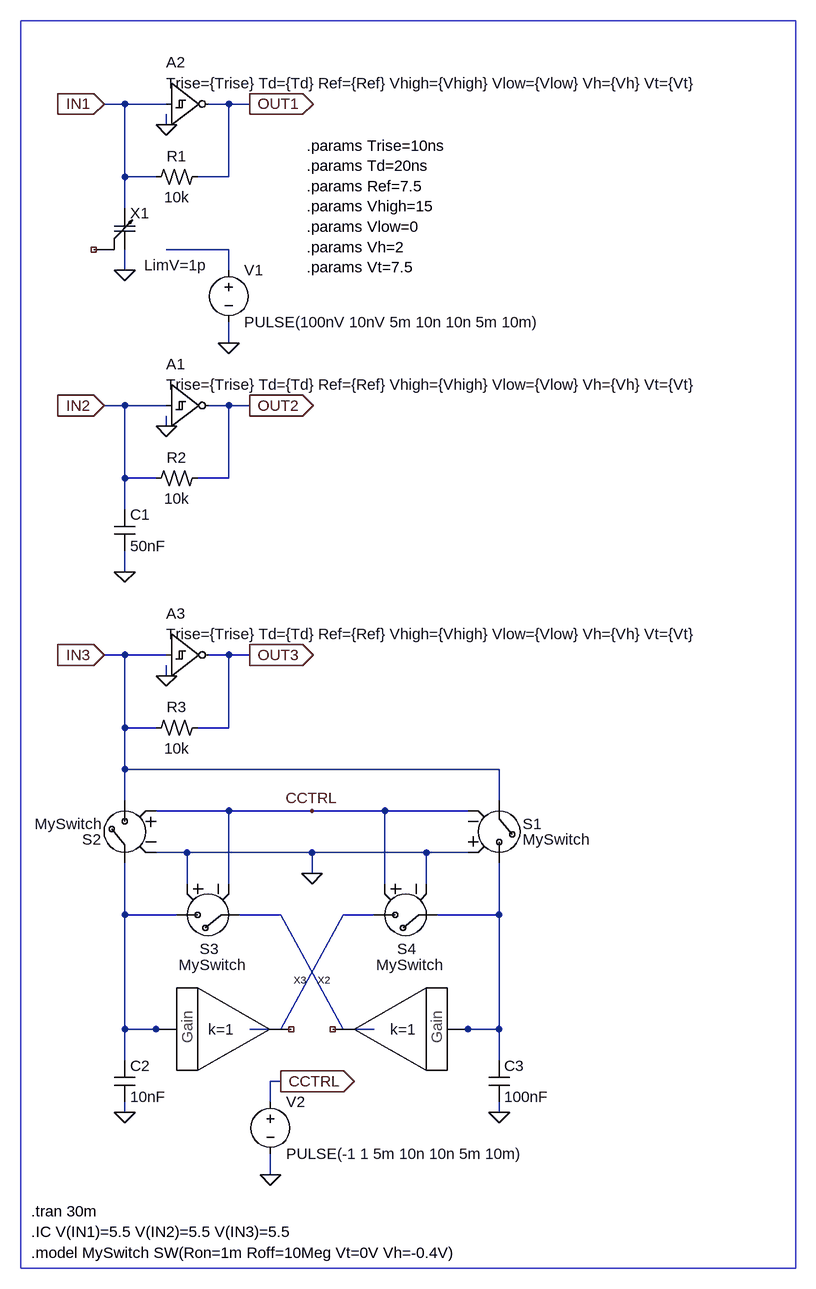
[diagram p0: schematic varicap-test.asc]
varicap-test.asc, the LTspice schematic file:
Version 4
SHEET 1 1536 1540
WIRE -224 -448 -256 -448
WIRE -160 -448 -224 -448
WIRE -64 -448 -96 -448
WIRE -32 -448 -64 -448
WIRE -160 -416 -160 -432
WIRE -224 -336 -224 -448
WIRE -176 -336 -224 -336
WIRE -64 -336 -64 -448
WIRE -64 -336 -112 -336
WIRE -224 -288 -224 -336
WIRE -64 -224 -160 -224
WIRE -224 -192 -224 -224
WIRE -64 -192 -64 -224
WIRE -64 -80 -64 -112
WIRE -224 16 -256 16
WIRE -160 16 -224 16
WIRE -64 16 -96 16
WIRE -32 16 -64 16
WIRE -160 48 -160 32
WIRE -224 128 -224 16
WIRE -176 128 -224 128
WIRE -64 128 -64 16
WIRE -64 128 -112 128
WIRE -224 176 -224 128
WIRE -224 272 -224 240
WIRE -224 400 -256 400
WIRE -160 400 -224 400
WIRE -64 400 -96 400
WIRE -32 400 -64 400
WIRE -160 432 -160 416
WIRE -224 512 -224 400
WIRE -176 512 -224 512
WIRE -64 512 -64 400
WIRE -64 512 -112 512
WIRE -224 576 -224 512
WIRE 352 576 -224 576
WIRE -224 624 -224 576
WIRE 352 624 352 576
WIRE -64 640 -176 640
WIRE 64 640 -64 640
WIRE 176 640 64 640
WIRE 304 640 176 640
WIRE -128 704 -176 704
WIRE 64 704 -128 704
WIRE 240 704 64 704
WIRE 304 704 240 704
WIRE 64 736 64 704
WIRE -128 752 -128 704
WIRE -64 752 -64 640
WIRE 176 752 176 640
WIRE 240 752 240 704
WIRE -224 800 -224 720
WIRE -144 800 -224 800
WIRE 16 800 -48 800
WIRE 160 800 112 800
WIRE 352 800 352 720
WIRE 352 800 256 800
WIRE -224 976 -224 800
WIRE -160 976 -224 976
WIRE 16 976 112 800
WIRE 16 976 -32 976
WIRE 112 976 16 800
WIRE 160 976 112 976
WIRE 352 976 352 800
WIRE 352 976 288 976
WIRE -224 1024 -224 976
WIRE 352 1024 352 976
WIRE 16 1056 0 1056
WIRE 0 1088 0 1056
WIRE -224 1104 -224 1088
WIRE 352 1104 352 1088
WIRE 0 1200 0 1168
FLAG -160 -416 0
FLAG -224 -192 0
FLAG -32 -448 OUT1
IOPIN -32 -448 Out
FLAG -256 -448 IN1
IOPIN -256 -448 In
FLAG -160 48 0
FLAG -32 16 OUT2
IOPIN -32 16 Out
FLAG -256 16 IN2
IOPIN -256 16 In
FLAG -224 272 0
FLAG -64 -80 0
FLAG -160 432 0
FLAG -32 400 OUT3
IOPIN -32 400 Out
FLAG -256 400 IN3
IOPIN -256 400 In
FLAG 0 1200 0
FLAG 16 1056 CCTRL
IOPIN 16 1056 Out
FLAG -224 1104 0
FLAG 352 1104 0
FLAG 64 640 CCTRL
FLAG 64 736 0
SYMBOL Digital\\schmtinv -160 -48 R0
WINDOW 0 0 0 Left 0
WINDOW 123 0 32 Left 0
SYMATTR InstName A1
SYMATTR Value2 Trise={Trise} Td={Td} Ref={Ref} Vhigh={Vhigh} Vlow={Vlow} Vh={Vh} Vt={Vt}
SYMBOL res2 -112 -352 R90
WINDOW 0 0 32 VBottom 0
WINDOW 3 32 32 VTop 0
SYMATTR InstName R1
SYMATTR Value 10k
SYMBOL Digital\\schmtinv -160 -512 R0
WINDOW 0 0 0 Left 0
WINDOW 123 0 32 Left 0
SYMATTR InstName A2
SYMATTR Value2 Trise={Trise} Td={Td} Ref={Ref} Vhigh={Vhigh} Vlow={Vlow} Vh={Vh} Vt={Vt}
SYMBOL res2 -112 112 R90
WINDOW 0 0 32 VBottom 0
WINDOW 3 32 32 VTop 0
SYMATTR InstName R2
SYMATTR Value 10k
SYMBOL cap -240 176 R0
SYMATTR InstName C1
SYMATTR Value 50nF
SYMBOL varicap -240 -288 R0
WINDOW 39 46 88 Left 0
SYMATTR SpiceLine LimV=1p
SYMATTR InstName X1
SYMBOL voltage -64 -208 R0
WINDOW 123 0 0 Left 0
WINDOW 39 0 0 Left 0
SYMATTR InstName V1
SYMATTR Value PULSE(100nV 10nV 5m 10n 10n 5m 10m)
SYMBOL Digital\\schmtinv -160 336 R0
WINDOW 0 0 0 Left 0
WINDOW 123 0 32 Left 0
SYMATTR InstName A3
SYMATTR Value2 Trise={Trise} Td={Td} Ref={Ref} Vhigh={Vhigh} Vlow={Vlow} Vh={Vh} Vt={Vt}
SYMBOL res2 -112 496 R90
WINDOW 0 0 32 VBottom 0
WINDOW 3 32 32 VTop 0
SYMATTR InstName R3
SYMATTR Value 10k
SYMBOL voltage 0 1072 R0
WINDOW 123 0 0 Left 0
WINDOW 39 0 0 Left 0
SYMATTR InstName V2
SYMATTR Value PULSE(-1 1 5m 10n 10n 5m 10m)
SYMBOL cap -240 1024 R0
SYMATTR InstName C2
SYMATTR Value 10nF
SYMBOL cap 336 1024 R0
SYMATTR InstName C3
SYMATTR Value 100nF
SYMBOL Gain -96 976 R0
WINDOW 39 0 0 Left 0
SYMATTR SpiceLine k=1
SYMATTR InstName X3
SYMBOL Gain 224 976 M0
WINDOW 39 0 0 Left 0
SYMATTR SpiceLine k=1
SYMATTR InstName X2
SYMBOL SWITCH 352 672 M180
SYMATTR InstName S1
SYMATTR Value MySwitch
SYMBOL SWITCH -224 672 M0
SYMATTR InstName S2
SYMATTR Value MySwitch
SYMBOL SWITCH -96 800 M90
WINDOW 0 52 -13 VRight 0
WINDOW 3 77 -45 VRight 0
SYMATTR InstName S3
SYMATTR Value MySwitch
SYMBOL SWITCH 208 800 M90
WINDOW 0 52 -13 VRight 0
WINDOW 3 77 -45 VRight 0
SYMATTR InstName S4
SYMATTR Value MySwitch
TEXT -368 1288 Left 0 !.IC V(IN1)=5.5 V(IN2)=5.5 V(IN3)=5.5
TEXT -368 1256 Left 0 !.tran 30m
TEXT 56 -384 Left 0 !.params Trise=10ns\n.params Td=20ns\n.params Ref=7.5\n.params Vhigh=15\n.params Vlow=0\n.params Vh=2\n.params Vt=7.5
TEXT -368 1320 Left 0 !.model MySwitch SW(Ron=1m Roff=10Meg Vt=0V Vh=-0.4V)
RECTANGLE Normal 808 1344 -384 -576

The netlist it stands for:
* varicap-test.asc
A1 IN2 0 0 0 0 OUT2 0 0 SCHMITT Trise={Trise} Td={Td} Ref={Ref} Vhigh={Vhigh} Vlow={Vlow} Vh={Vh} Vt={Vt}
R1 OUT1 IN1 10k
A2 IN1 0 0 0 0 OUT1 0 0 SCHMITT Trise={Trise} Td={Td} Ref={Ref} Vhigh={Vhigh} Vlow={Vlow} Vh={Vh} Vt={Vt}
R2 OUT2 IN2 10k
C1 IN2 0 50nF
XX1 IN1 0 NC_01 varicap LimV=1p  ; pins A B CTRL
V1 N001 0 PULSE(100nV 10nV 5m 10n 10n 5m 10m)
A3 IN3 0 0 0 0 OUT3 0 0 SCHMITT Trise={Trise} Td={Td} Ref={Ref} Vhigh={Vhigh} Vlow={Vlow} Vh={Vh} Vt={Vt}
R3 OUT3 IN3 10k
V2 CCTRL 0 PULSE(-1 1 5m 10n 10n 5m 10m)
C2 N002 0 10nF
C3 N005 0 100nF
XX3 N002 NC_02 GAIN k=1  ; pins In out
XX2 N005 NC_03 GAIN k=1  ; pins In out
S1 IN3 N005 0 CCTRL MySwitch
S2 N002 IN3 CCTRL 0 MySwitch
S3 N003 N002 0 CCTRL MySwitch
S4 N005 N004 CCTRL 0 MySwitch
.IC V(IN1)=5.5 V(IN2)=5.5 V(IN3)=5.5
.tran 30m
.params Trise=10ns
.params Td=20ns
.params Ref=7.5
.params Vhigh=15
.params Vlow=0
.params Vh=2
.params Vt=7.5
.model MySwitch SW(Ron=1m Roff=10Meg Vt=0V Vh=-0.4V)
.backanno
.end